# Altium schematic sheet Ticketing_Slave.SchDoc
size A4; Author: Mario Dos Santos; Organization: ETML-ES; Address1: Avenue Recordon 1; Address2: 1004 Lausanne; Address3: Switzerland; Revision: C; SheetNumber: 1; SheetTotal: 5
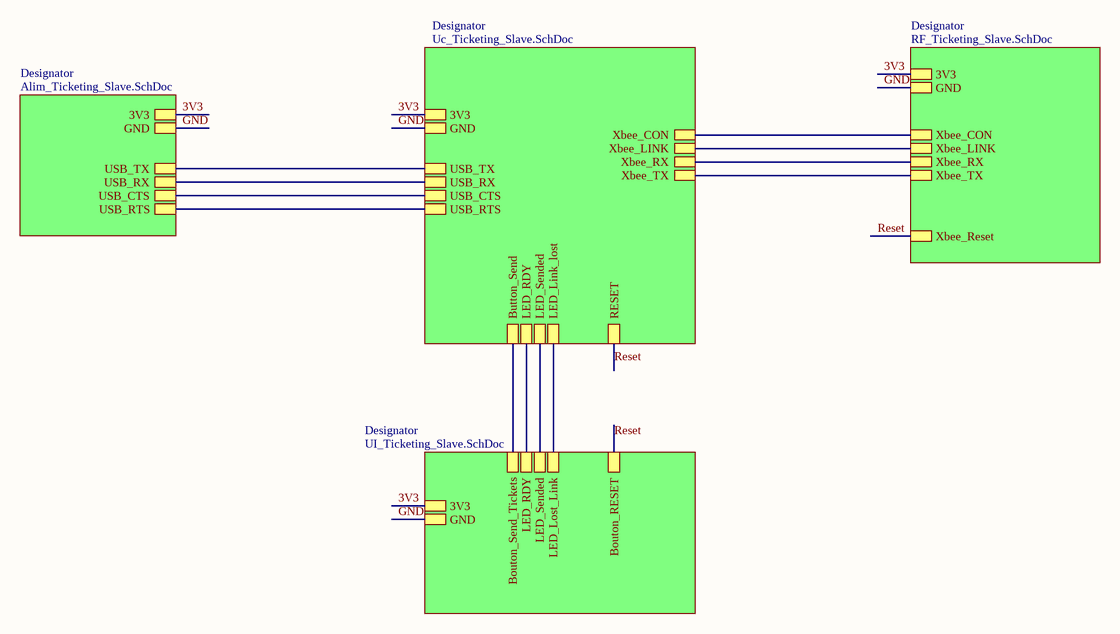
[diagram p0: Ticketing_Slave.SchDoc]

## Sub-sheets
Designator = Uc_Ticketing_Slave.SchDoc: 3V3, GND, Xbee_CON, Xbee_LINK, Xbee_RX, Xbee_TX, Button_Send, LED_Link_lost, LED_Sended, LED_RDY, RESET, USB_TX, USB_RX, USB_CTS, USB_RTS
Designator = RF_Ticketing_Slave.SchDoc: GND, Xbee_Reset, Xbee_CON, 3V3, Xbee_LINK, Xbee_RX, Xbee_TX
Designator = UI_Ticketing_Slave.SchDoc: 3V3, GND, Bouton_RESET, LED_RDY, LED_Sended, LED_Lost_Link, Bouton_Send_Tickets
Designator = Alim_Ticketing_Slave.SchDoc: GND, 3V3, USB_TX, USB_RX, USB_CTS, USB_RTS

## Nets
3V3: sheet Designator/3V3, sheet Designator/3V3, sheet Designator/3V3, sheet Designator/3V3
GND: sheet Designator/GND, sheet Designator/GND, sheet Designator/GND, sheet Designator/GND
Reset: sheet Designator/RESET, sheet Designator/Xbee_Reset, sheet Designator/Bouton_RESET
(unnamed): sheet Designator/Xbee_CON, sheet Designator/Xbee_CON
(unnamed): sheet Designator/Xbee_LINK, sheet Designator/Xbee_LINK
(unnamed): sheet Designator/Xbee_RX, sheet Designator/Xbee_RX
(unnamed): sheet Designator/Xbee_TX, sheet Designator/Xbee_TX
(unnamed): sheet Designator/Button_Send, sheet Designator/Bouton_Send_Tickets
(unnamed): sheet Designator/LED_Link_lost, sheet Designator/LED_Lost_Link
(unnamed): sheet Designator/LED_Sended, sheet Designator/LED_Sended
(unnamed): sheet Designator/LED_RDY, sheet Designator/LED_RDY
(unnamed): sheet Designator/USB_TX, sheet Designator/USB_TX
(unnamed): sheet Designator/USB_RX, sheet Designator/USB_RX
(unnamed): sheet Designator/USB_CTS, sheet Designator/USB_CTS
(unnamed): sheet Designator/USB_RTS, sheet Designator/USB_RTS

## Notes on the sheet
- Fichier :
- a
- Date :
- Heure :
- Version :
- Auteur :
- Modif.
- b
- c
- d
- Projet :
- No :
- Nb feuilles
- Feuille n°
- Chemin :